# EasyEDA schematic ESP-HI-C3-RevA-schematic.json

## Sheets
1 01 MCU, crystal and reset
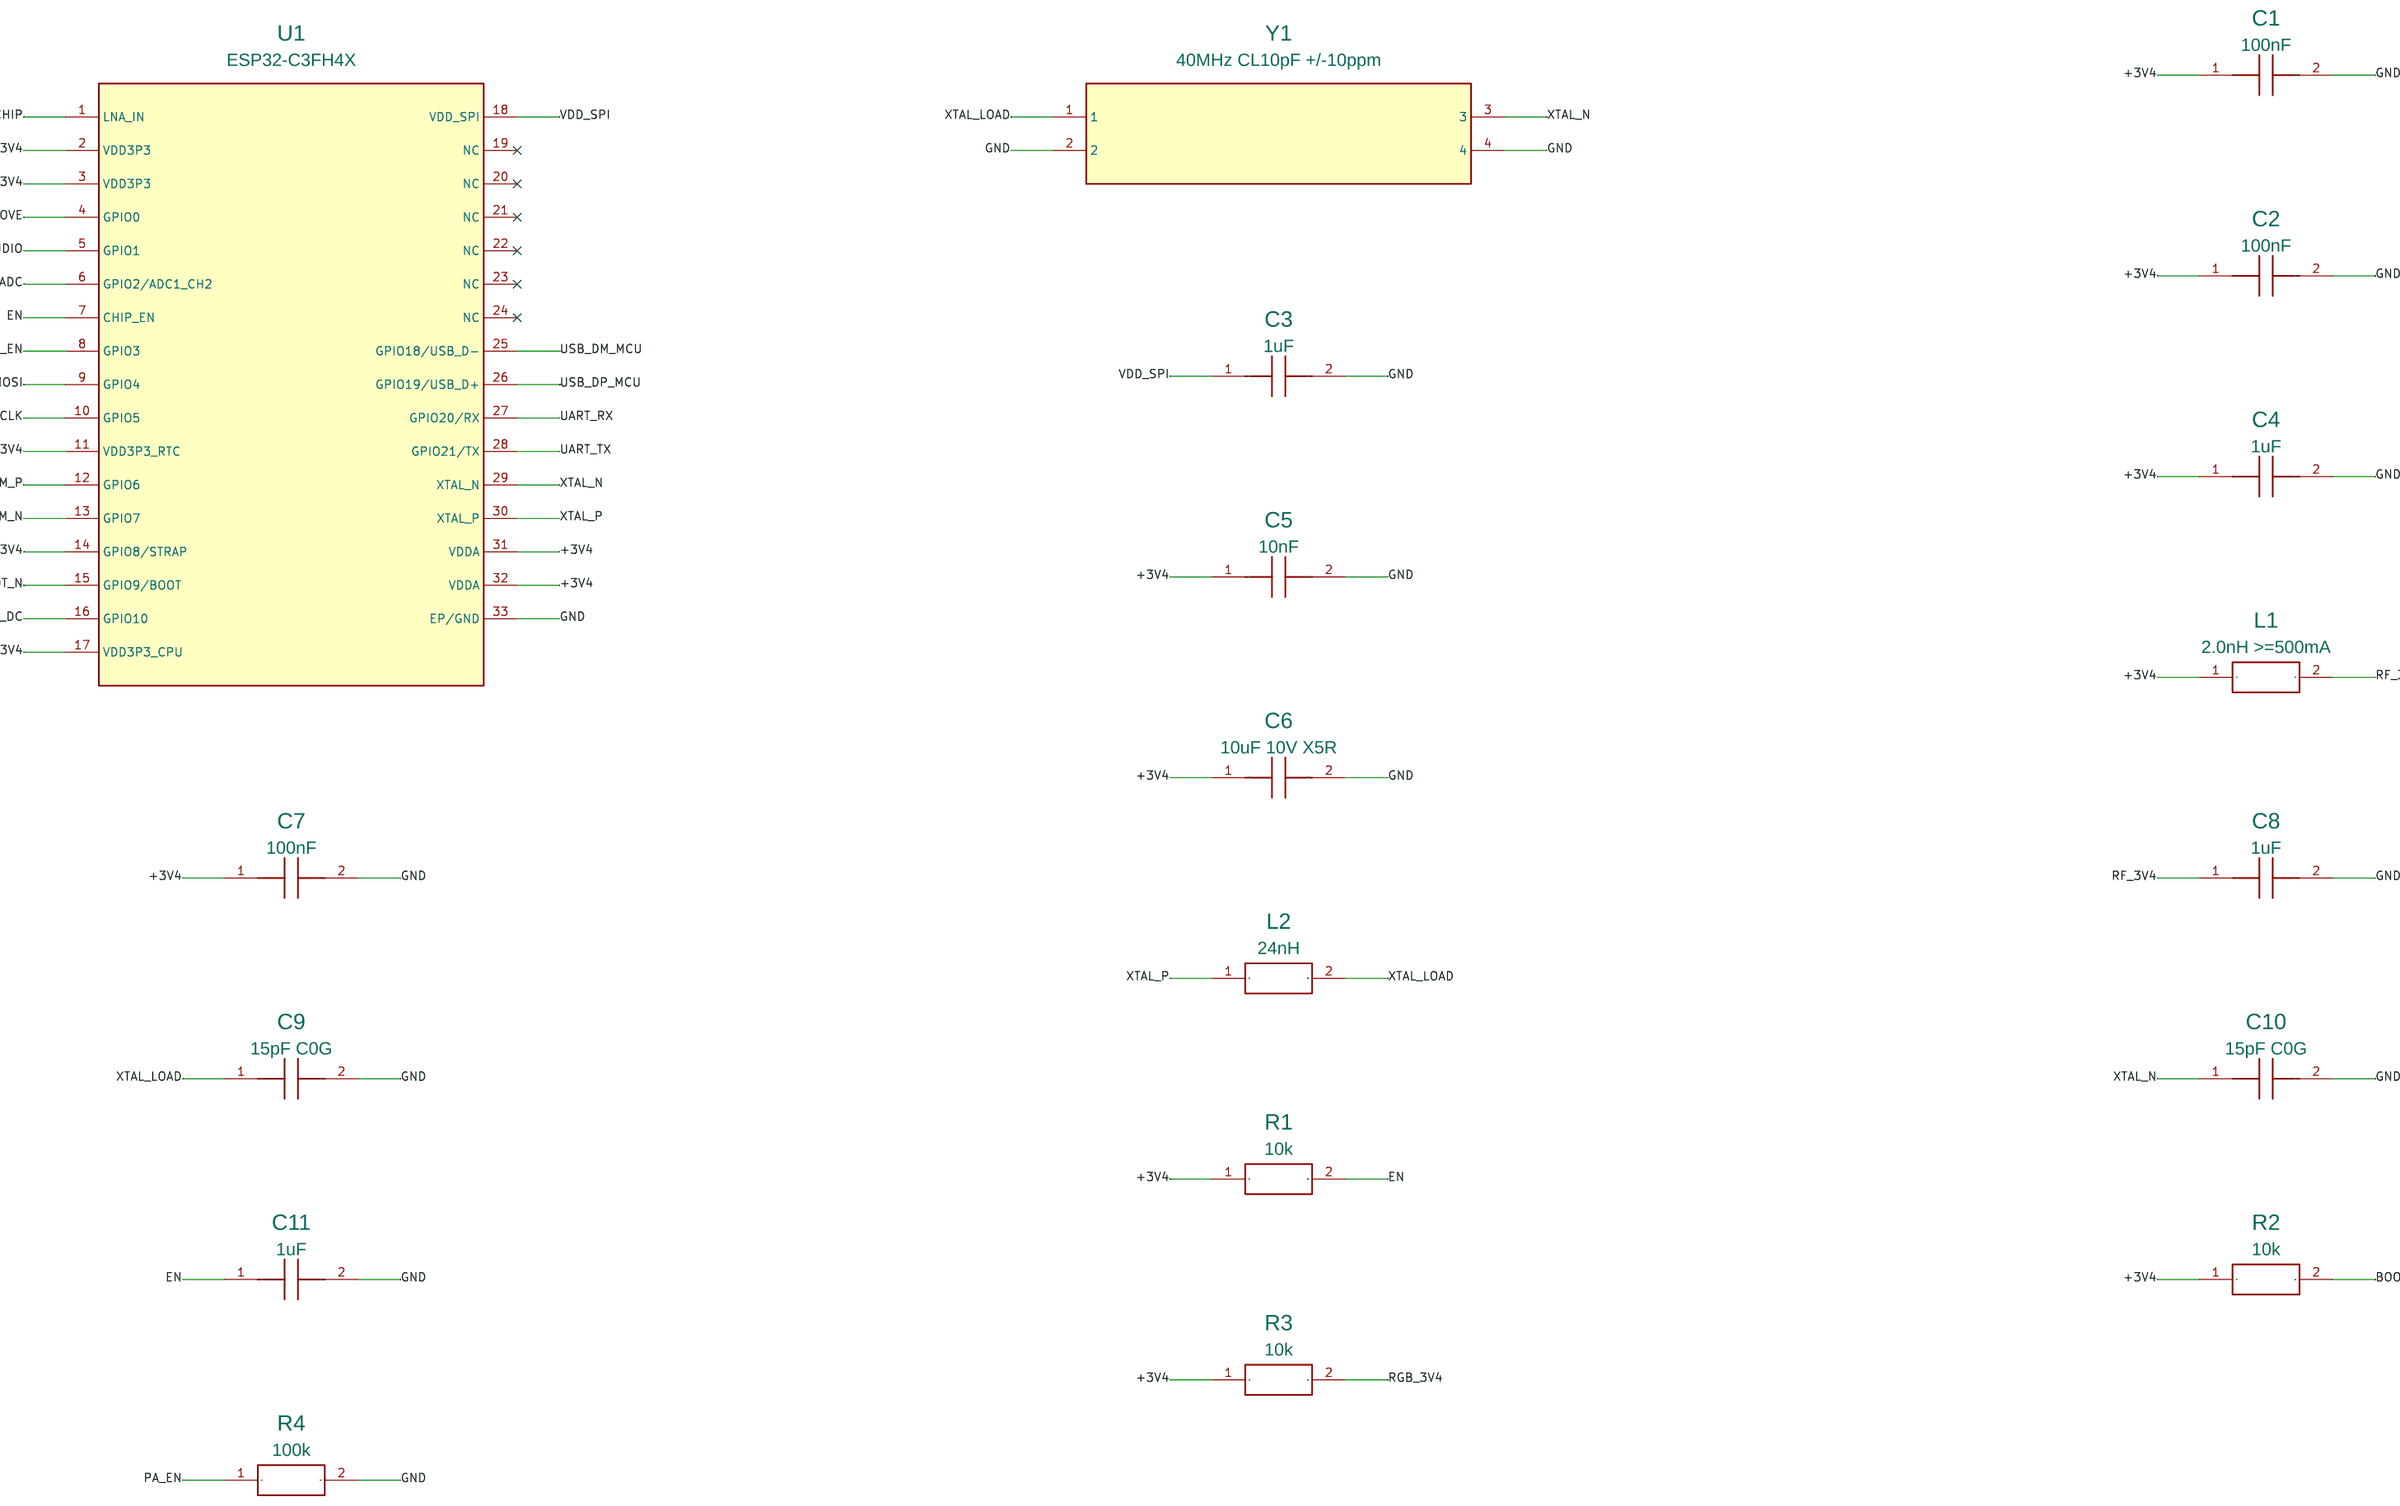
[diagram p0: 01 MCU, crystal and reset]
2 02 External antenna and matching
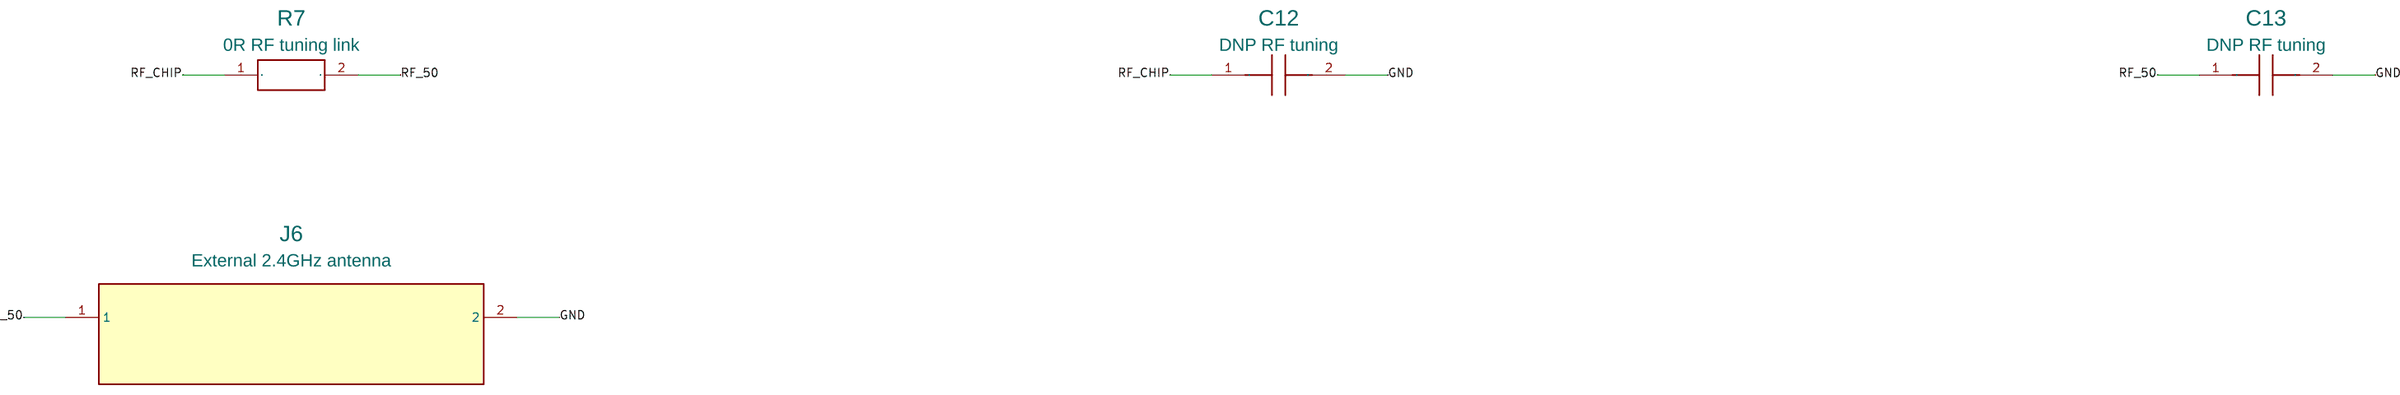
[diagram p1: 02 External antenna and matching]
3 03 USB-C and regulated supply
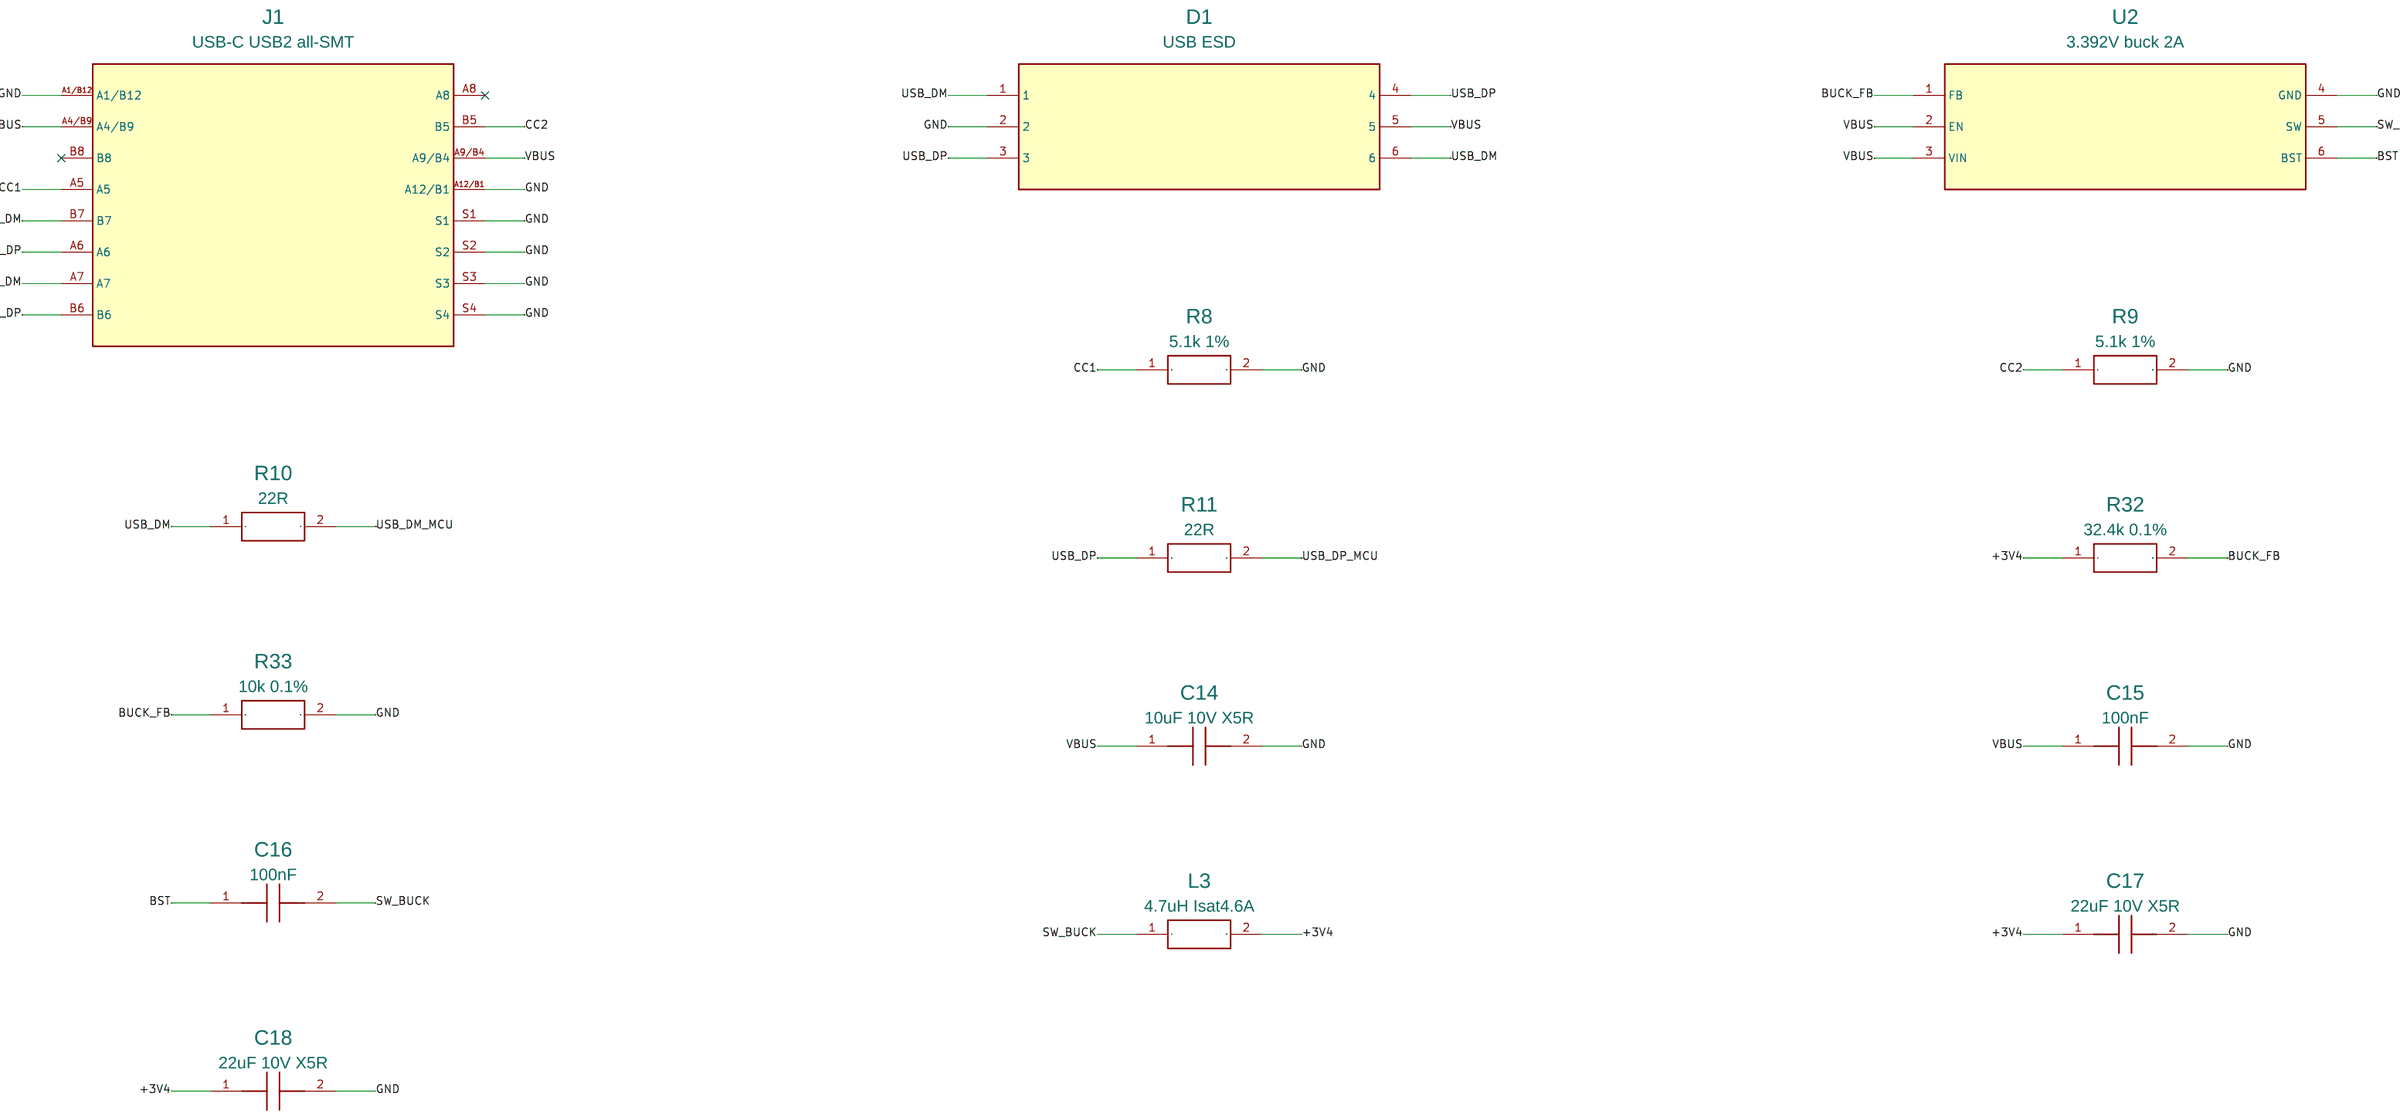
[diagram p2: 03 USB-C and regulated supply]
4 04 128x160 SPI display
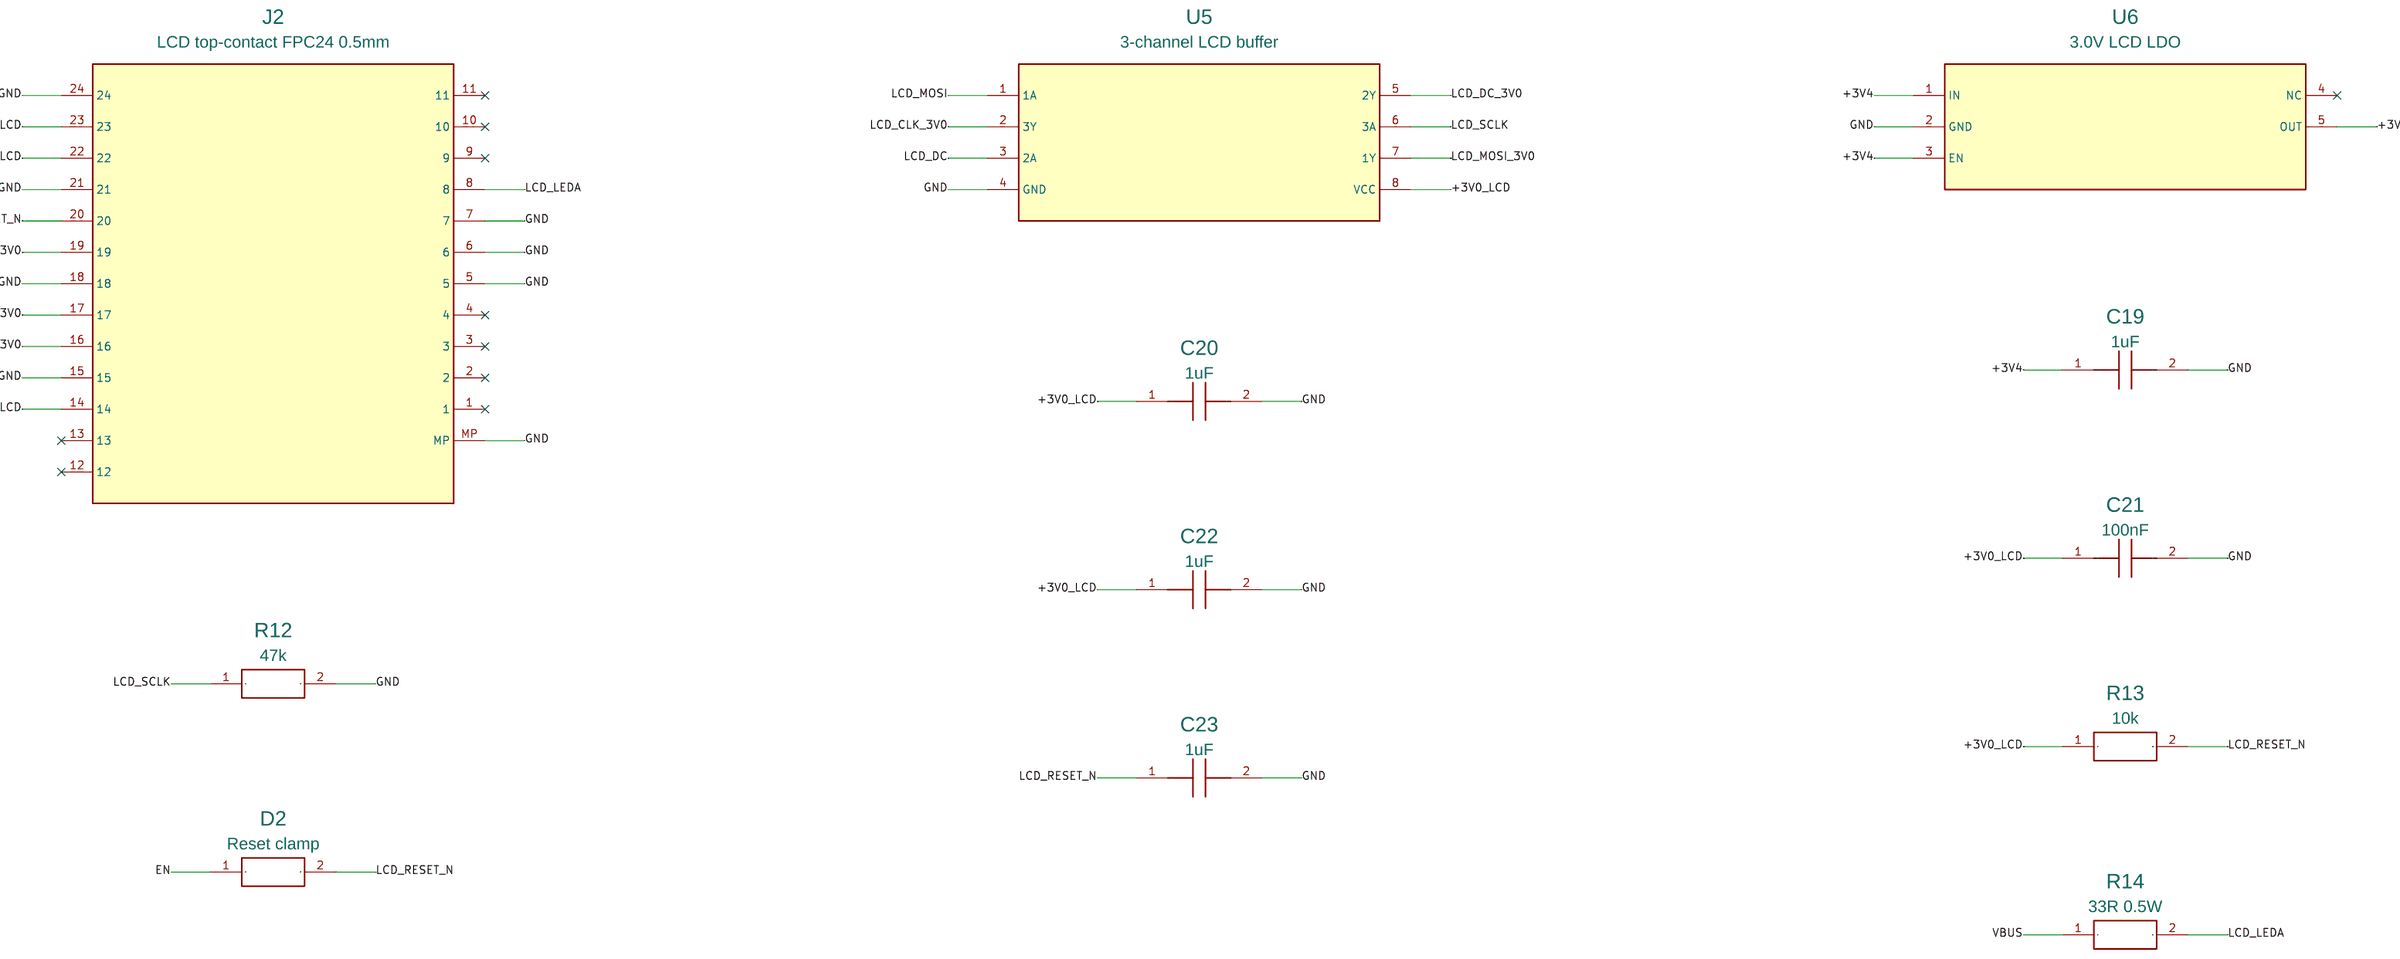
[diagram p3: 04 128x160 SPI display]
5 05 PDM reconstruction and speaker
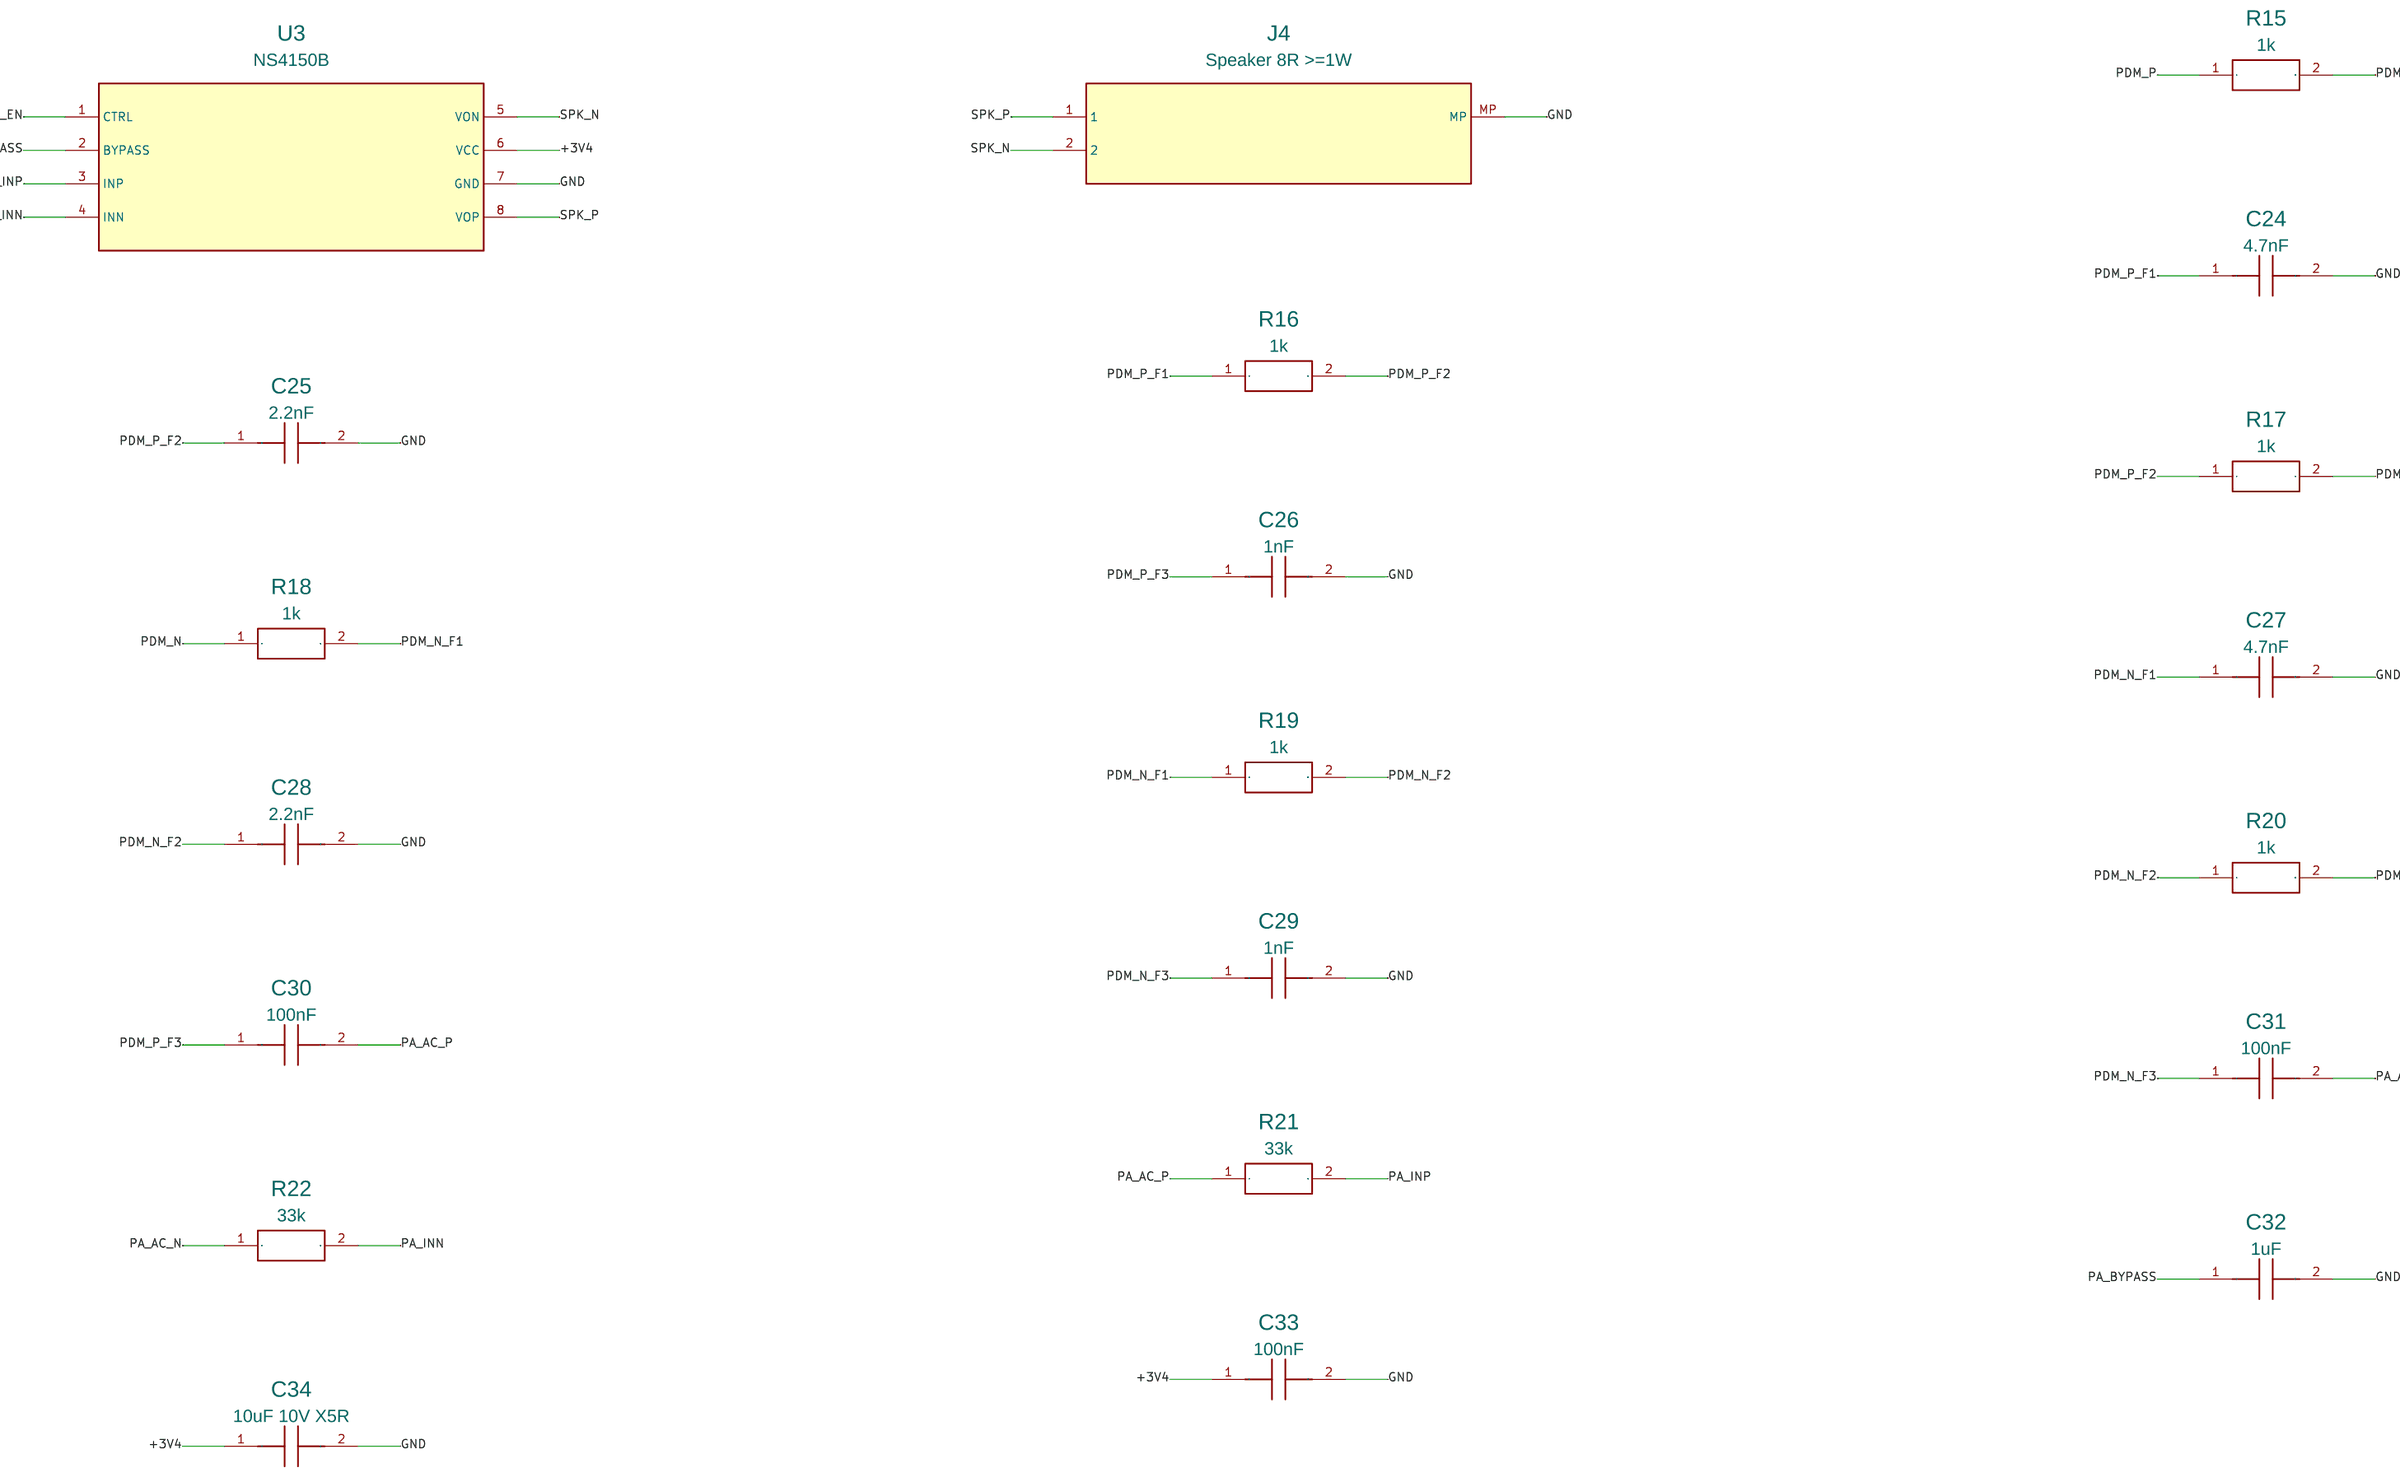
[diagram p4: 05 PDM reconstruction and speaker]
6 06 Electret microphone and ADC
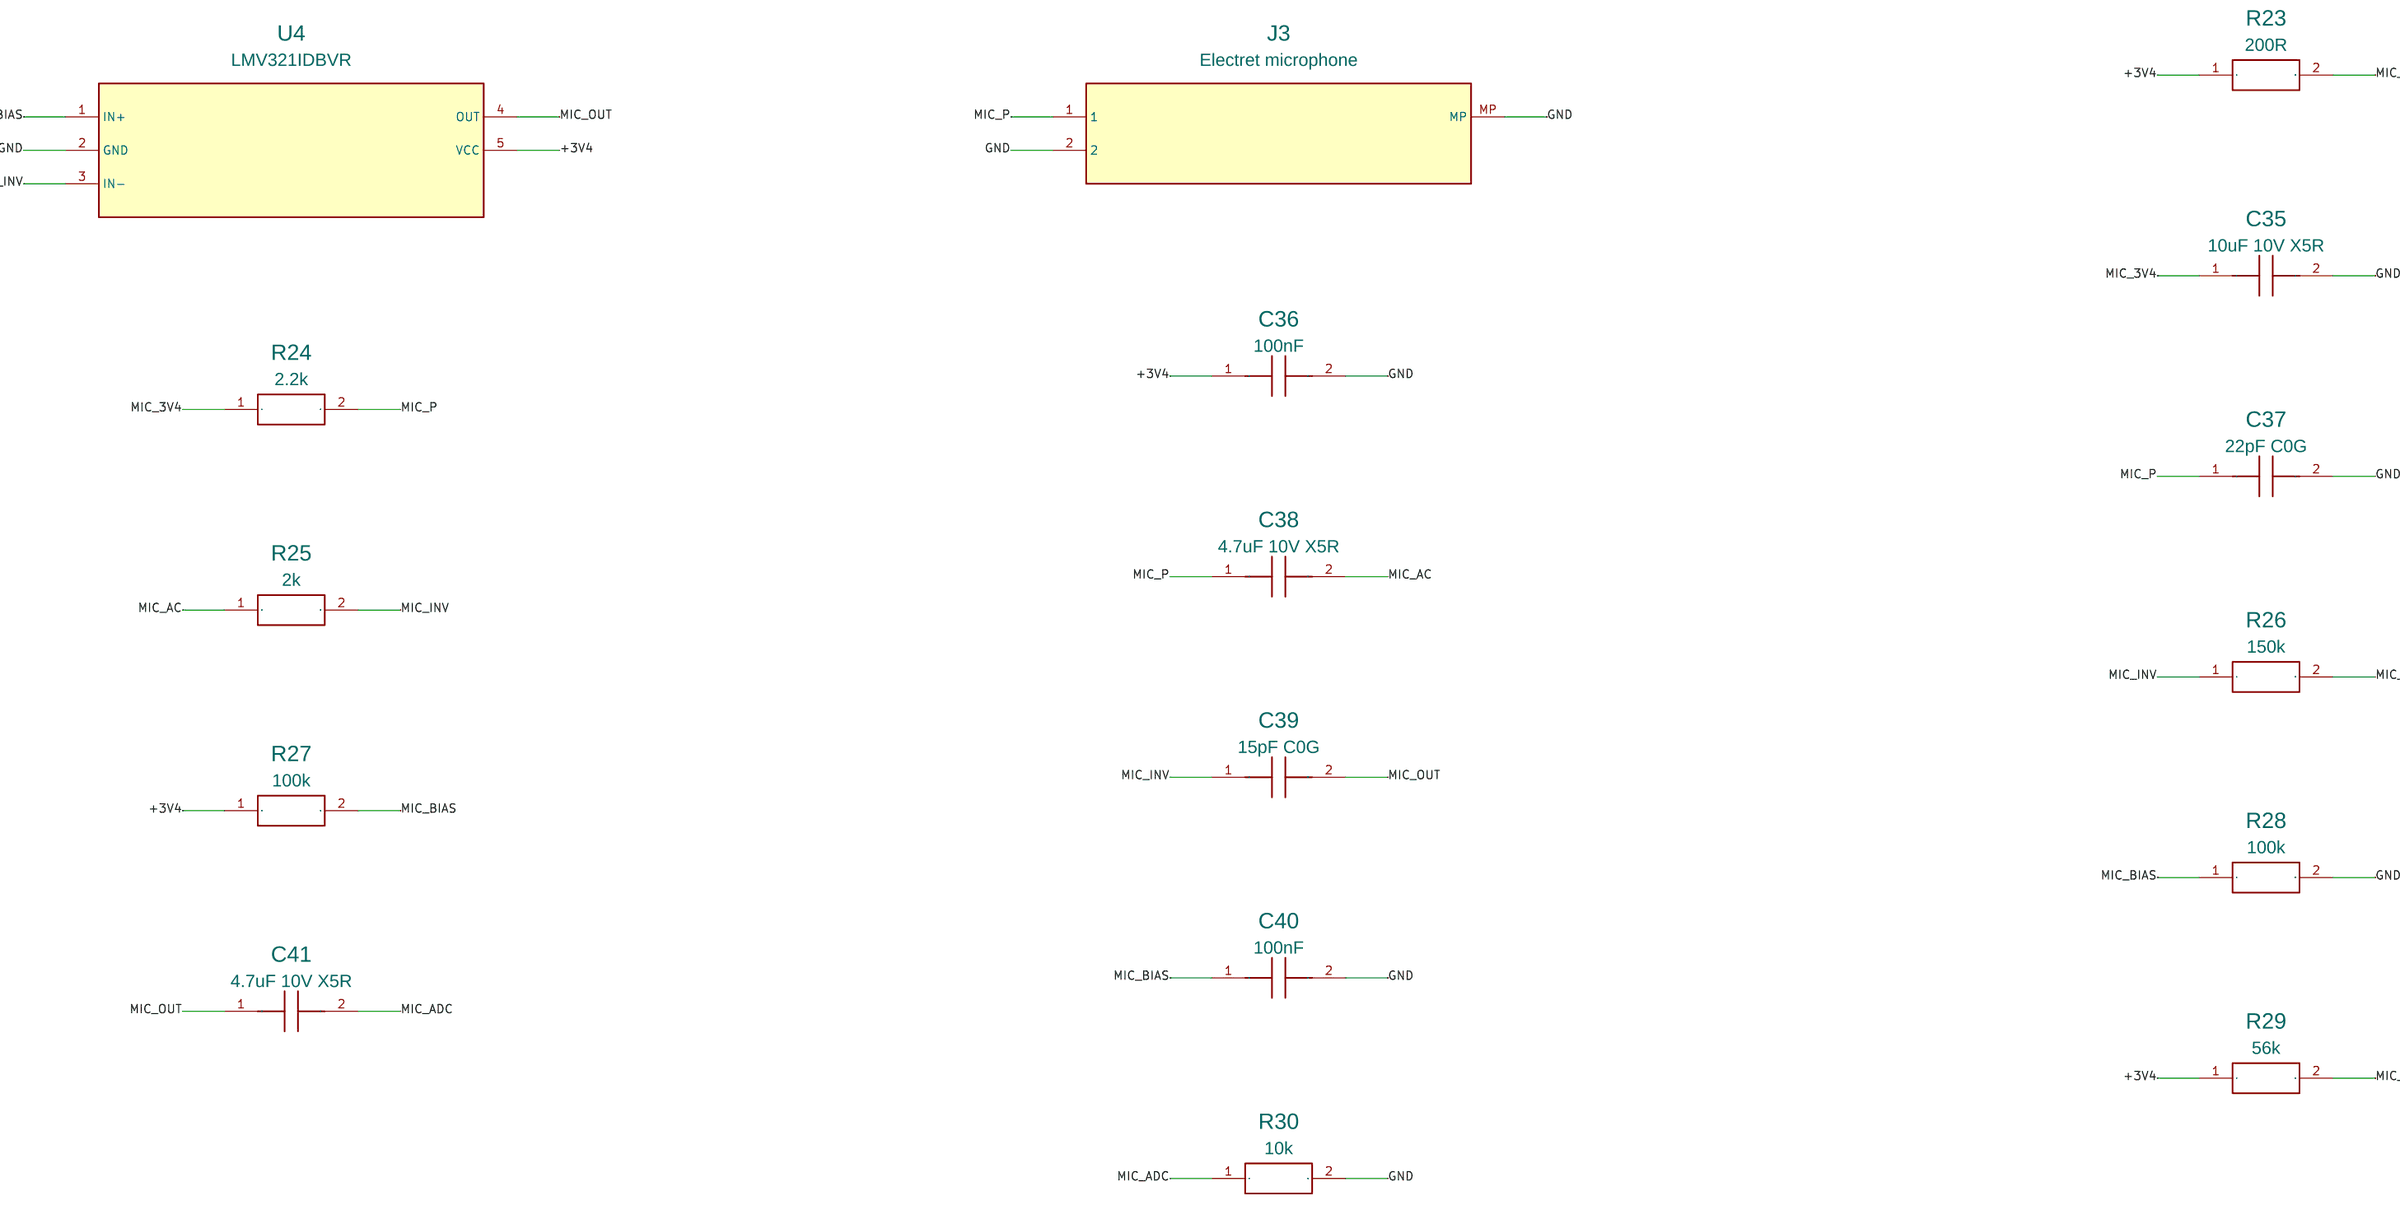
[diagram p5: 06 Electret microphone and ADC]
7 07 Buttons, RGB and external IO
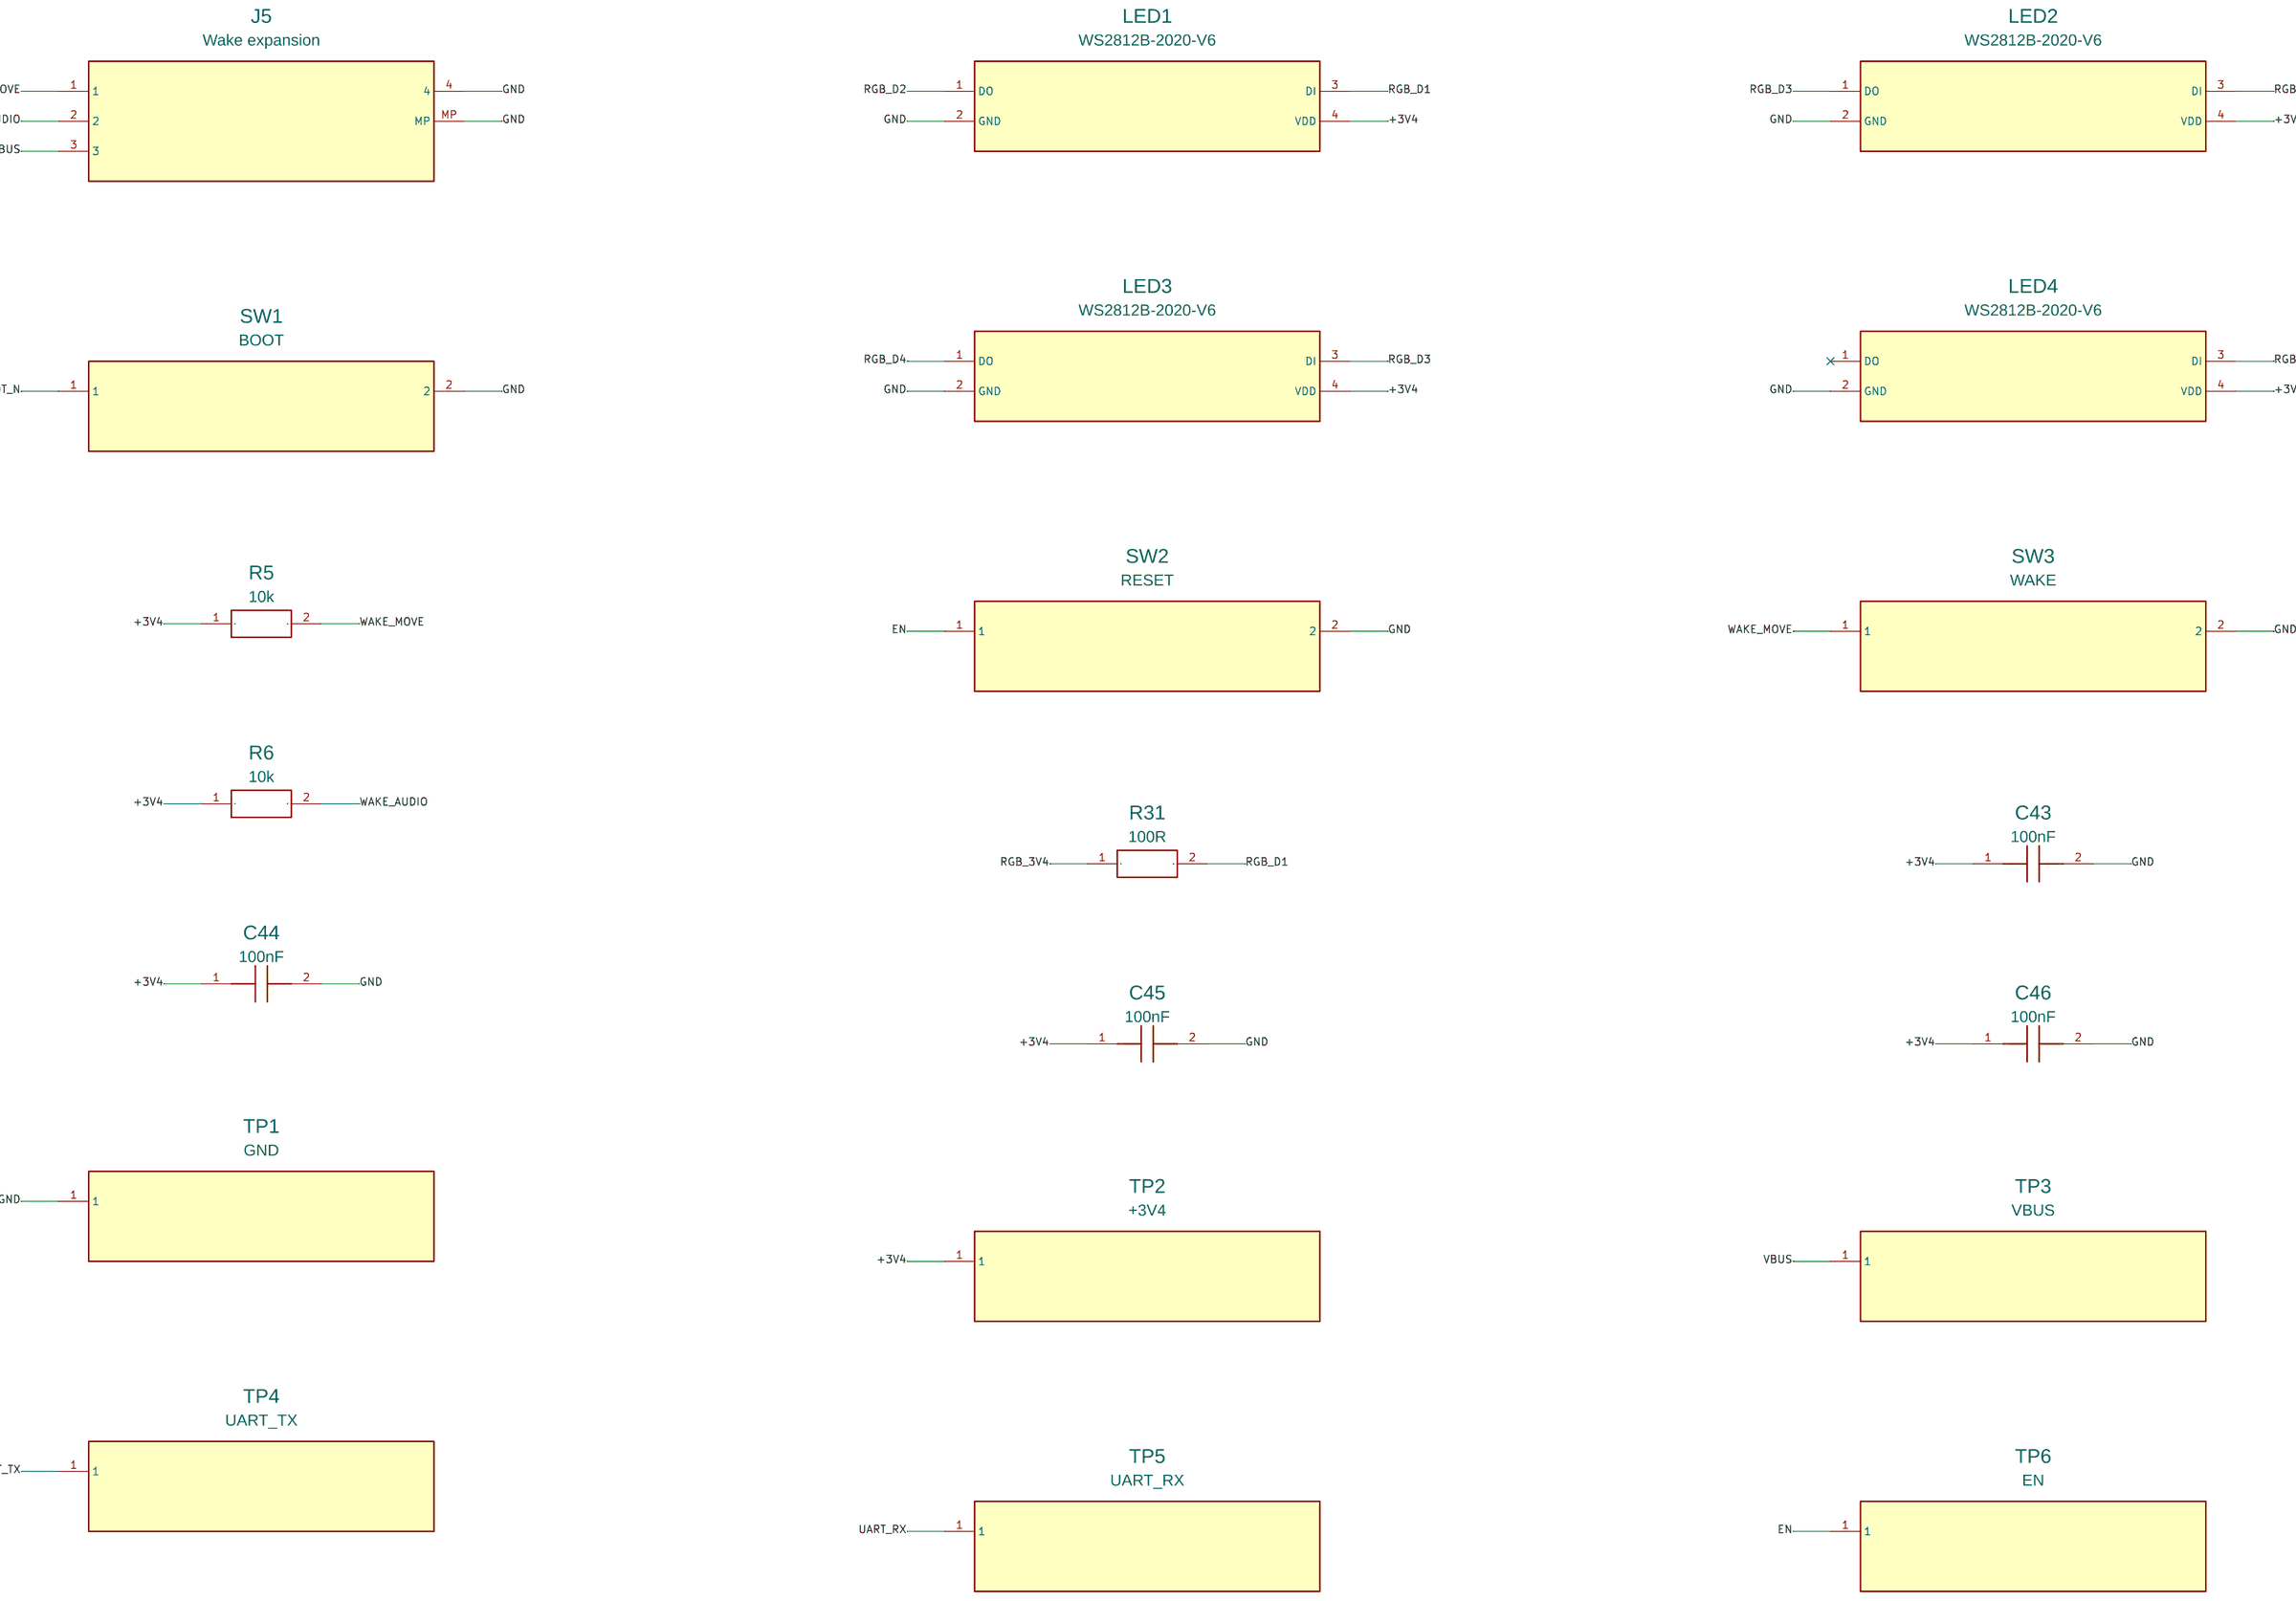
[diagram p6: 07 Buttons, RGB and external IO]

## Parts
sheet 01 MCU, crystal and reset
C1  100nF  [R_0402_1005Metric]
C2  100nF  [R_0402_1005Metric]
C3  1uF  [R_0402_1005Metric]
C4  1uF  [R_0402_1005Metric]
C5  10nF  [R_0402_1005Metric]
C6  10uF 10V X5R  [R_0603_1608Metric]
C7  100nF  [R_0402_1005Metric]
C8  1uF  [R_0402_1005Metric]
C9  15pF C0G  [R_0402_1005Metric]
C10  15pF C0G  [R_0402_1005Metric]
C11  1uF  [R_0402_1005Metric]
L1  2.0nH >=500mA  [R_0402_1005Metric]
L2  24nH  [R_0402_1005Metric]
R1  10k  [R_0402_1005Metric]
R2  10k  [R_0402_1005Metric]
R3  10k  [R_0402_1005Metric]
R4  100k  [R_0402_1005Metric]
U1  ESP32-C3FH4X  [QFN-32-1EP_5x5mm_P0.5mm_EP3.45x3.45mm]
Y1  40MHz CL10pF +/-10ppm  [EPSON_FA20H]
sheet 02 External antenna and matching
C12  DNP RF tuning  [R_0402_1005Metric]
C13  DNP RF tuning  [R_0402_1005Metric]
J6  External 2.4GHz antenna  [U.FL_Hirose_U.FL-R-SMT-1_Vertical]
R7  0R RF tuning link  [R_0402_1005Metric]
sheet 03 USB-C and regulated supply
C14  10uF 10V X5R  [R_0603_1608Metric]
C15  100nF  [R_0402_1005Metric]
C16  100nF  [R_0402_1005Metric]
C17  22uF 10V X5R  [R_0805_2012Metric]
C18  22uF 10V X5R  [R_0805_2012Metric]
D1  USB ESD  [SOT-23-6]
J1  USB-C USB2 all-SMT  [GCT_USB4110_GF_A]
L3  4.7uH Isat4.6A  [L_Coilcraft_XxL4030]
R8  5.1k 1%  [R_0402_1005Metric]
R9  5.1k 1%  [R_0402_1005Metric]
R10  22R  [R_0402_1005Metric]
R11  22R  [R_0402_1005Metric]
R32  32.4k 0.1%  [R_0402_1005Metric]
R33  10k 0.1%  [R_0402_1005Metric]
U2  3.392V buck 2A  [TSOT-23-6]
sheet 04 128x160 SPI display
C19  1uF  [R_0402_1005Metric]
C20  1uF  [R_0402_1005Metric]
C21  100nF  [R_0402_1005Metric]
C22  1uF  [R_0402_1005Metric]
C23  1uF  [R_0402_1005Metric]
D2  Reset clamp  [D_SOD-323]
J2  LCD top-contact FPC24 0.5mm  [Molex_52435_2471]
R12  47k  [R_0402_1005Metric]
R13  10k  [R_0402_1005Metric]
R14  33R 0.5W  [R_1210_3225Metric]
U5  3-channel LCD buffer  [VSSOP-8_2.3x2mm_P0.5mm]
U6  3.0V LCD LDO  [SOT-23-5]
sheet 05 PDM reconstruction and speaker
C24  4.7nF  [R_0402_1005Metric]
C25  2.2nF  [R_0402_1005Metric]
C26  1nF  [R_0402_1005Metric]
C27  4.7nF  [R_0402_1005Metric]
C28  2.2nF  [R_0402_1005Metric]
C29  1nF  [R_0402_1005Metric]
C30  100nF  [R_0402_1005Metric]
C31  100nF  [R_0402_1005Metric]
C32  1uF  [R_0402_1005Metric]
C33  100nF  [R_0402_1005Metric]
C34  10uF 10V X5R  [R_0603_1608Metric]
J4  Speaker 8R >=1W  [JST_SH_SM02B-SRSS-TB_1x02-1MP_P1.00mm_Horizontal]
R15  1k  [R_0402_1005Metric]
R16  1k  [R_0402_1005Metric]
R17  1k  [R_0402_1005Metric]
R18  1k  [R_0402_1005Metric]
R19  1k  [R_0402_1005Metric]
R20  1k  [R_0402_1005Metric]
R21  33k  [R_0402_1005Metric]
R22  33k  [R_0402_1005Metric]
U3  NS4150B  [MSOP-8_3x3mm_P0.65mm]
sheet 06 Electret microphone and ADC
C35  10uF 10V X5R  [R_0603_1608Metric]
C36  100nF  [R_0402_1005Metric]
C37  22pF C0G  [R_0402_1005Metric]
C38  4.7uF 10V X5R  [R_0603_1608Metric]
C39  15pF C0G  [R_0402_1005Metric]
C40  100nF  [R_0402_1005Metric]
C41  4.7uF 10V X5R  [R_0603_1608Metric]
J3  Electret microphone  [JST_SH_SM02B-SRSS-TB_1x02-1MP_P1.00mm_Horizontal]
R23  200R  [R_0402_1005Metric]
R24  2.2k  [R_0402_1005Metric]
R25  2k  [R_0402_1005Metric]
R26  150k  [R_0402_1005Metric]
R27  100k  [R_0402_1005Metric]
R28  100k  [R_0402_1005Metric]
R29  56k  [R_0402_1005Metric]
R30  10k  [R_0402_1005Metric]
U4  LMV321IDBVR  [SOT-23-5]
sheet 07 Buttons, RGB and external IO
C43  100nF  [R_0402_1005Metric]
C44  100nF  [R_0402_1005Metric]
C45  100nF  [R_0402_1005Metric]
C46  100nF  [R_0402_1005Metric]
J5  Wake expansion  [JST_SH_SM04B-SRSS-TB_1x04-1MP_P1.00mm_Horizontal]
LED1  WS2812B-2020-V6  [WS2812B_2020_V6]
LED2  WS2812B-2020-V6  [WS2812B_2020_V6]
LED3  WS2812B-2020-V6  [WS2812B_2020_V6]
LED4  WS2812B-2020-V6  [WS2812B_2020_V6]
R5  10k  [R_0402_1005Metric]
R6  10k  [R_0402_1005Metric]
R31  100R  [R_0402_1005Metric]
SW1  BOOT  [SW_SPST_PTS810]
SW2  RESET  [SW_SPST_PTS810]
SW3  WAKE  [SW_SPST_PTS810]
TP1  GND  [TestPad_1mm]
TP2  +3V4  [TestPad_1mm]
TP3  VBUS  [TestPad_1mm]
TP4  UART_TX  [TestPad_1mm]
TP5  UART_RX  [TestPad_1mm]
TP6  EN  [TestPad_1mm]

## Library data of the parts
C1-C11 C14-C41 C43-C46 L1 L2 LED1-LED4 R1-R33 TP1-TP6 U1 U3 U4 = -: Contributor: ESP-HI chip project; BOM: yes
Y1 = -: Manufacturer Part: FA-20H 40.0000MF10Z-K3; Contributor: ESP-HI chip project; BOM: yes
C12 C13 = -: Contributor: ESP-HI chip project; BOM: no
J6 = -: Manufacturer Part: U.FL-R-SMT-1(10); Contributor: ESP-HI chip project; BOM: yes
D1 = -: Manufacturer Part: USBLC6-2SC6; Contributor: ESP-HI chip project; BOM: yes
J1 = -: Manufacturer Part: USB4110-GF-A; Contributor: ESP-HI chip project; BOM: yes
L3 = -: Manufacturer Part: XAL4030-472MEC; Contributor: ESP-HI chip project; BOM: yes
U2 = -: Manufacturer Part: AP63200WU-7; Contributor: ESP-HI chip project; BOM: yes
D2 = -: Manufacturer Part: BAT54WS; Contributor: ESP-HI chip project; BOM: yes
J2 = -: Manufacturer Part: 52435-2471; Contributor: ESP-HI chip project; BOM: yes
U5 = -: Manufacturer Part: SN74LVC3G17DCUR; Contributor: ESP-HI chip project; BOM: yes
U6 = -: Manufacturer Part: TLV70030DDCR; Contributor: ESP-HI chip project; BOM: yes
J3 J4 = -: Manufacturer Part: SM02B-SRSS-TB(LF)(SN); Contributor: ESP-HI chip project; BOM: yes
J5 = -: Manufacturer Part: SM04B-SRSS-TB(LF)(SN); Contributor: ESP-HI chip project; BOM: yes
SW1-SW3 = -: Manufacturer Part: PTS810 SJM 250 SMTR LFS; Contributor: ESP-HI chip project; BOM: yes

## Nets
+3V0_LCD: C20.1 C21.1 C22.1 J2.14 J2.22 J2.23 R13.1 U5.8(VCC) U6.5(OUT)
+3V4: C1.1 C2.1 C4.1 C5.1 C6.1 C7.1 C17.1 C18.1 C19.1 C33.1 C34.1 C36.1 C43.1 C44.1 C45.1 C46.1 L1.1 L3.2 LED1.4(VDD) LED2.4(VDD) LED3.4(VDD) LED4.4(VDD) R1.1 R2.1 R3.1 R5.1 R6.1 R23.1 R27.1 R29.1 R32.1 TP2.1 U1.11(VDD3P3_RTC) U1.17(VDD3P3_CPU) U1.31(VDDA) U1.32(VDDA) U3.6(VCC) U4.5(VCC) U6.1(IN) U6.3(EN)
GND: C1.2 C2.2 C3.2 C4.2 C5.2 C6.2 C7.2 C8.2 C9.2 C10.2 C11.2 C12.2 C13.2 C14.2 C15.2 C17.2 C18.2 C19.2 C20.2 C21.2 C22.2 C23.2 C24.2 C25.2 C26.2 C27.2 C28.2 C29.2 C32.2 C33.2 C34.2 C35.2 C36.2 C37.2 C40.2 C43.2 C44.2 C45.2 C46.2 D1.2 J1.A1/B12 J1.A12/B1 J1.S1 J1.S2 J1.S3 J1.S4 J2.5 J2.6 J2.7 J2.15 J2.18 J2.21 J2.24 J2.MP J3.2 J3.MP J4.MP J5.4 J5.MP J6.2 LED1.2(GND) LED2.2(GND) LED3.2(GND) LED4.2(GND) R4.2 R8.2 R9.2 R12.2 R28.2 R30.2 R33.2 SW1.2 SW2.2 SW3.2 TP1.1 U1.33(EP/GND) U2.4(GND) U3.7(GND) U4.2(GND) U5.4(GND) U6.2(GND) Y1.2 Y1.4
VBUS: C14.1 C15.1 D1.5 J1.A4/B9 J1.A9/B4 J5.3 R14.1 TP3.1 U2.2(EN) U2.3(VIN)
VDD_SPI: C3.1 U1.18(VDD_SPI)
BOOT_N: R2.2 SW1.1 U1.15(GPIO9/BOOT)
BST: C16.1 U2.6(BST)
BUCK_FB: R32.2 R33.1 U2.1(FB)
CC1: J1.A5 R8.1
CC2: J1.B5 R9.1
EN: C11.1 D2.1 R1.2 SW2.1 TP6.1 U1.7(CHIP_EN)
LCD_CLK_3V0: J2.16 U5.2(3Y)
LCD_DC: U1.16(GPIO10) U5.3(2A)
LCD_DC_3V0: J2.17 U5.5(2Y)
LCD_LEDA: J2.8 R14.2
LCD_MOSI: U1.9(GPIO4) U5.1(1A)
LCD_MOSI_3V0: J2.19 U5.7(1Y)
LCD_RESET_N: C23.1 D2.2 J2.20 R13.2
LCD_SCLK: R12.1 U1.10(GPIO5) U5.6(3A)
MIC_3V4: C35.1 R23.2 R24.1
MIC_AC: C38.2 R25.1
MIC_ADC: C41.2 R29.2 R30.1 U1.6(GPIO2/ADC1_CH2)
MIC_BIAS: C40.1 R27.2 R28.1 U4.1(IN+)
MIC_INV: C39.1 R25.2 R26.1 U4.3(IN-)
MIC_OUT: C39.2 C41.1 R26.2 U4.4(OUT)
MIC_P: C37.1 C38.1 J3.1 R24.2
PA_AC_N: C31.2 R22.1
PA_AC_P: C30.2 R21.1
PA_BYPASS: C32.1 U3.2(BYPASS)
PA_EN: R4.1 U1.8(GPIO3) U3.1(CTRL)
PA_INN: R22.2 U3.4(INN)
PA_INP: R21.2 U3.3(INP)
PDM_N: R18.1 U1.13(GPIO7)
PDM_N_F1: C27.1 R18.2 R19.1
PDM_N_F2: C28.1 R19.2 R20.1
PDM_N_F3: C29.1 C31.1 R20.2
PDM_P: R15.1 U1.12(GPIO6)
PDM_P_F1: C24.1 R15.2 R16.1
PDM_P_F2: C25.1 R16.2 R17.1
PDM_P_F3: C26.1 C30.1 R17.2
RF_3V4: C8.1 L1.2 U1.2(VDD3P3) U1.3(VDD3P3)
RF_50: C13.1 J6.1 R7.2
RF_CHIP: C12.1 R7.1 U1.1(LNA_IN)
RGB_3V4: R3.2 R31.1 U1.14(GPIO8/STRAP)
RGB_D1: LED1.3(DI) R31.2
RGB_D2: LED1.1(DO) LED2.3(DI)
RGB_D3: LED2.1(DO) LED3.3(DI)
RGB_D4: LED3.1(DO) LED4.3(DI)
SPK_N: J4.2 U3.5(VON)
SPK_P: J4.1 U3.8(VOP)
SW_BUCK: C16.2 L3.1 U2.5(SW)
UART_RX: TP5.1 U1.27(GPIO20/RX)
UART_TX: TP4.1 U1.28(GPIO21/TX)
USB_DM: D1.1 D1.6 J1.A7 J1.B7 R10.1
USB_DM_MCU: R10.2 U1.25(GPIO18/USB_D-)
USB_DP: D1.3 D1.4 J1.A6 J1.B6 R11.1
USB_DP_MCU: R11.2 U1.26(GPIO19/USB_D+)
WAKE_AUDIO: J5.2 R6.2 U1.5(GPIO1)
WAKE_MOVE: J5.1 R5.2 SW3.1 U1.4(GPIO0)
XTAL_LOAD: C9.1 L2.2 Y1.1
XTAL_N: C10.1 U1.29(XTAL_N) Y1.3
XTAL_P: L2.1 U1.30(XTAL_P)

Not connected (* = marked no-connect by the designer): J1 A8* B8*; J2 1* 2* 3* 4* 9* 10* 11* 12* 13*; LED4 1(DO)*; U1 19(NC)* 20(NC)* 21(NC)* 22(NC)* 23(NC)* 24(NC)*; U6 4(NC)*

## Notes on the sheets
sheet 1
- ESP-HI C3 CHIP REV A / 01 MCU, crystal and reset
- DRAFT - native ERC and physical verification pending. GPIO identities retained.
sheet 2
- ESP-HI C3 CHIP REV A / 02 External antenna and matching
- DRAFT - native ERC and physical verification pending. GPIO identities retained.
sheet 3
- ESP-HI C3 CHIP REV A / 03 USB-C and regulated supply
- DRAFT - native ERC and physical verification pending. GPIO identities retained.
sheet 4
- ESP-HI C3 CHIP REV A / 04 128x160 SPI display
- DRAFT - native ERC and physical verification pending. GPIO identities retained.
sheet 5
- ESP-HI C3 CHIP REV A / 05 PDM reconstruction and speaker
- DRAFT - native ERC and physical verification pending. GPIO identities retained.
sheet 6
- ESP-HI C3 CHIP REV A / 06 Electret microphone and ADC
- DRAFT - native ERC and physical verification pending. GPIO identities retained.
sheet 7
- ESP-HI C3 CHIP REV A / 07 Buttons, RGB and external IO
- DRAFT - native ERC and physical verification pending. GPIO identities retained.
